# Altium schematic sheet BPF.SchDoc: BPF
size A2 portrait; DocumentNumber: 13; Revision: 2.0; SheetNumber: 13; SheetTotal: 18; DocumentName: Лист 1.SCHDOC
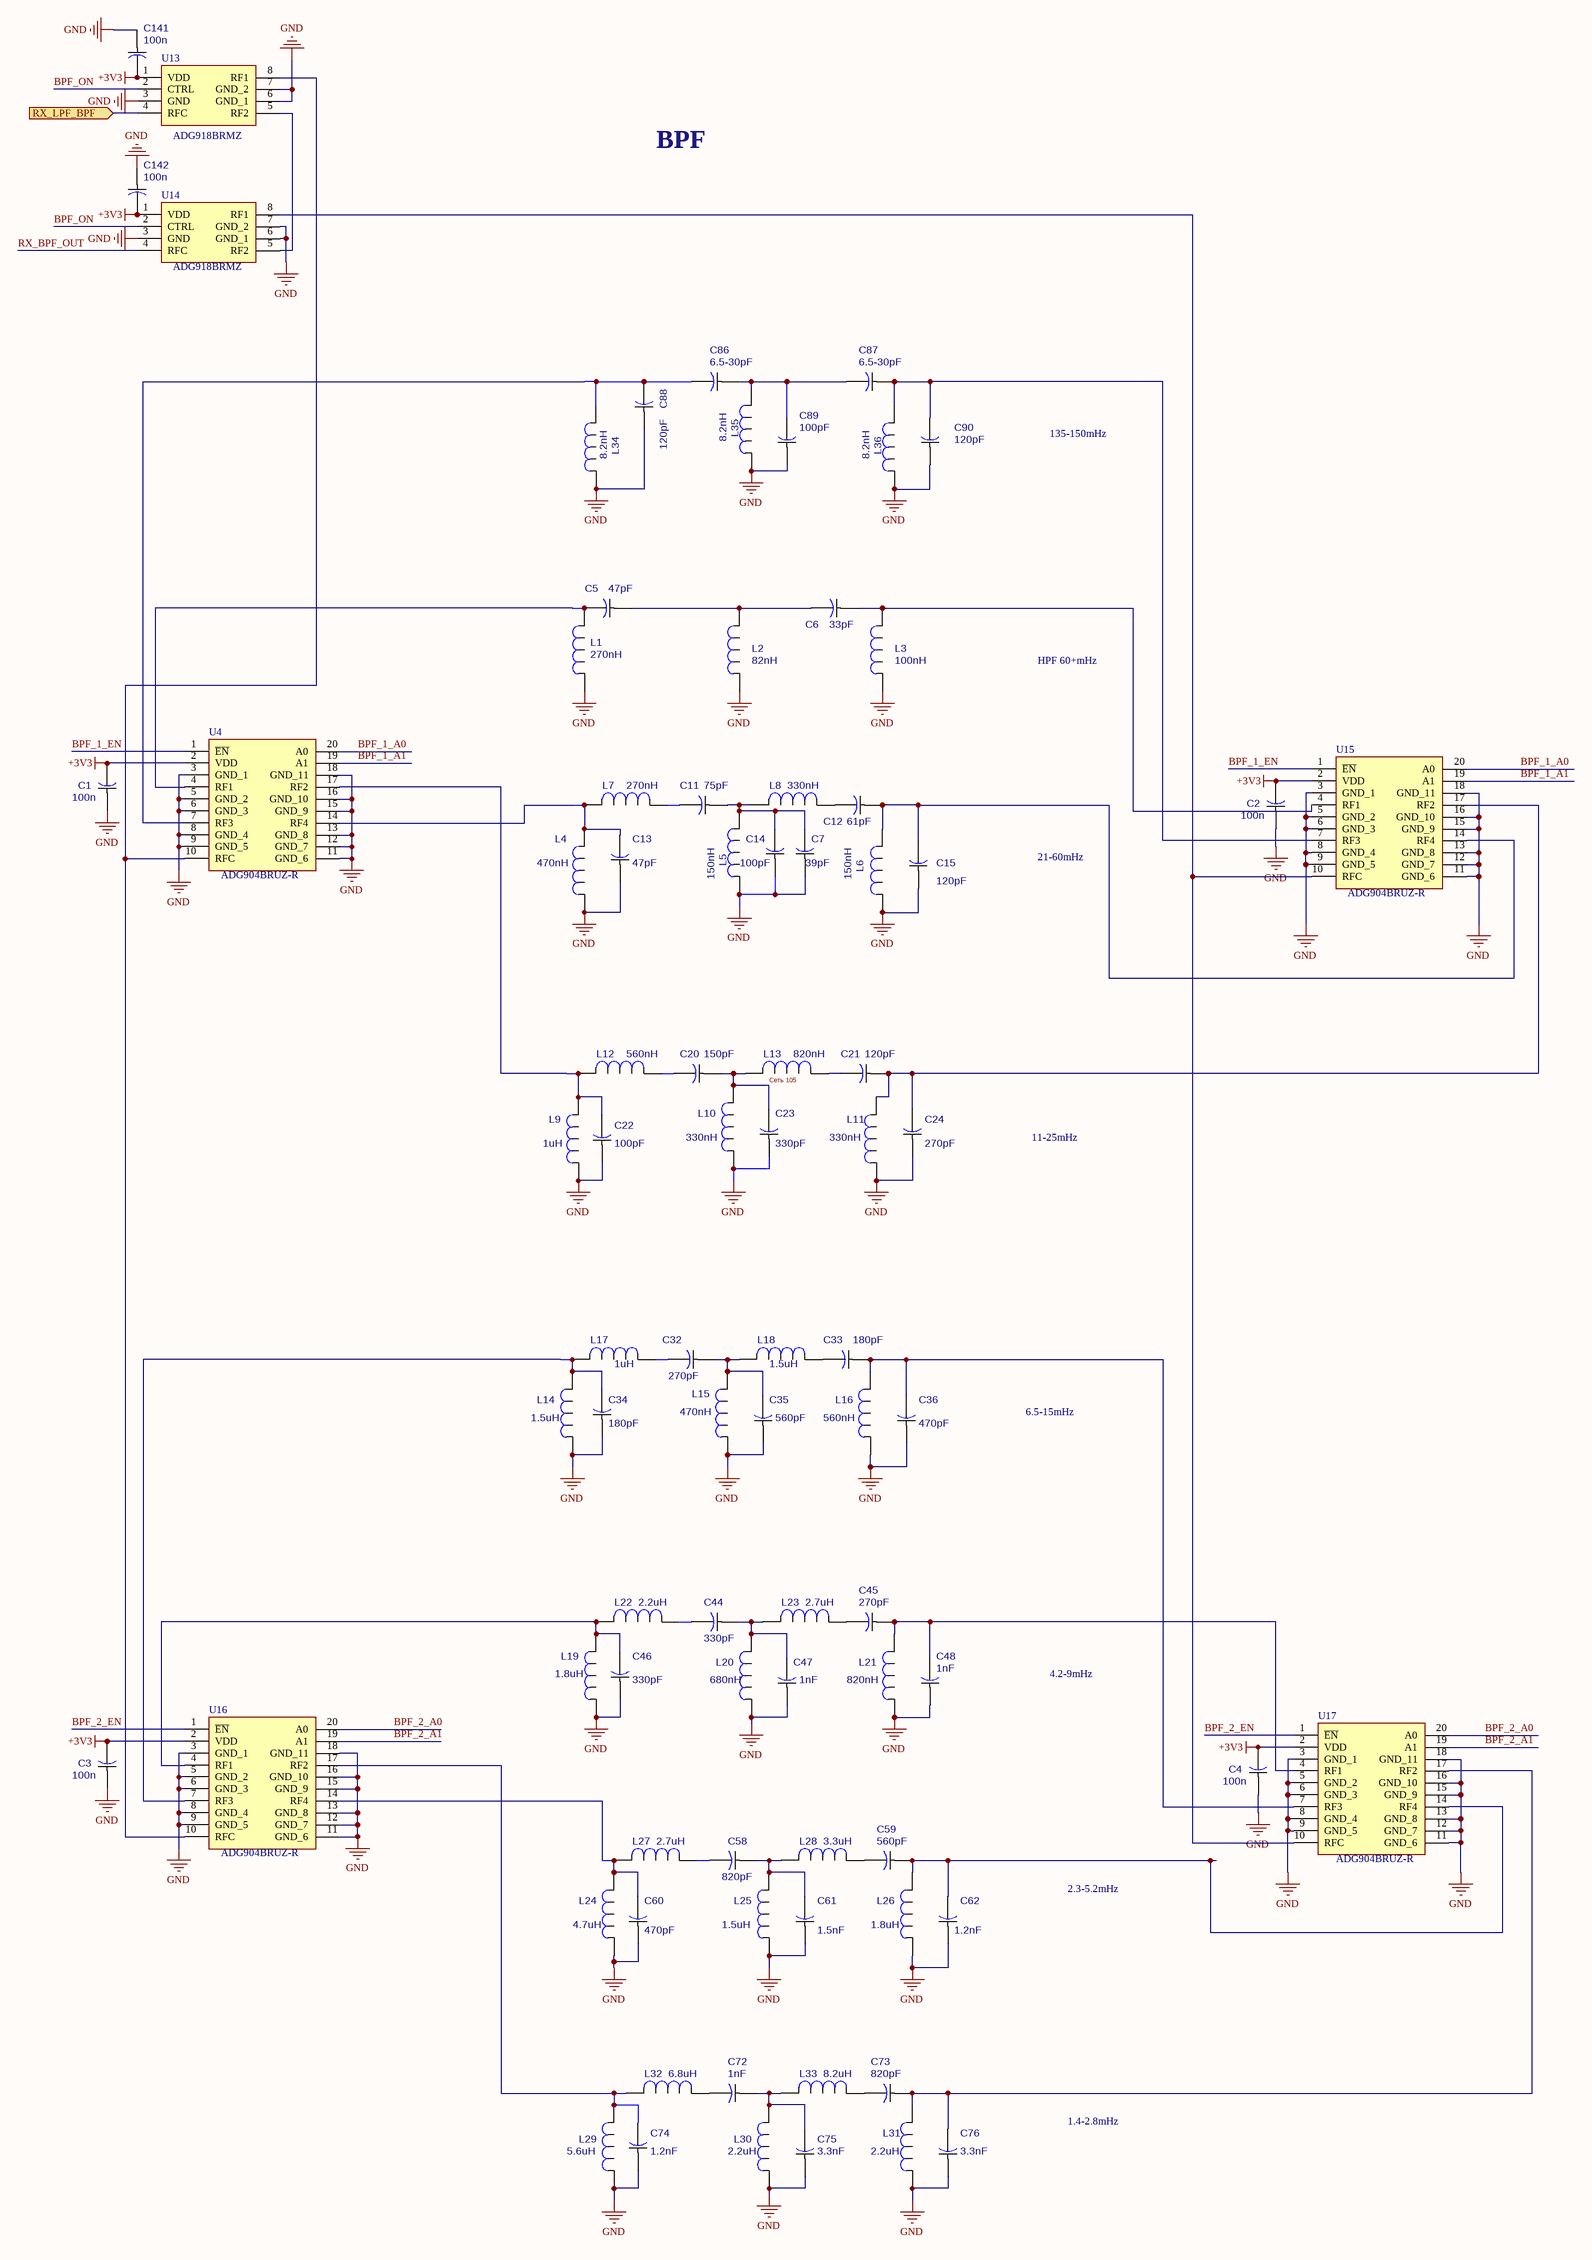
[diagram p0: BPF.SchDoc]

## Parts
C1  100n  [CAP_0805]
C2  100n  [CAP_0805]
C3  100n  [CAP_0805]
C4  100n  [CAP_0805]
C5  47pF  [CAP_0805]
C6  33pF  [CAP_0805]
C7  39pF  [CAP_0805]
C11  75pF  [CAP_0805]
C12  61pF  [CAP_0805]
C13  47pF  [CAP_0805]
C14  100pF  [CAP_0805]
C15  120pF  [CAP_0805]
C20  150pF  [CAP_0805]
C21  120pF  [CAP_0805]
C22  100pF  [CAP_0805]
C23  330pF  [CAP_0805]
C24  270pF  [CAP_0805]
C32  270pF  [CAP_0805]
C33  180pF  [CAP_0805]
C34  180pF  [CAP_0805]
C35  560pF  [CAP_0805]
C36  470pF  [CAP_0805]
C44  330pF  [CAP_0805]
C45  value 270pF  [CAP_0805]  (hidden comment: 51pF)
C46  330pF  [CAP_0805]
C47  1nF  [CAP_0805]
C48  1nF  [CAP_0805]
C58  820pF  [CAP_0805]
C59  value 560pF  [CAP_0805]  (hidden comment: 680pF)
C60  470pF  [CAP_0805]
C61  1.5nF  [CAP_0805]
C62  1.2nF  [CAP_0805]
C72  1nF  [CAP_0805]
C73  820pF  [CAP_0805]
C74  1.2nF  [CAP_0805]
C75  3.3nF  [CAP_0805]
C76  3.3nF  [CAP_0805]
C86  6.5-30pF  [5025[2010]]
C87  6.5-30pF  [5025[2010]]
C88  120pF  [CAP_0805]
C89  100pF  [CAP_0805]
C90  120pF  [CAP_0805]
C141  100n  [CAP_0805]
C142  100n  [CAP_0805]
L1  270nH  [IND_0805]
L2  82nH  [IND_0805]
L3  100nH  [IND_0805]
L4  470nH  [IND_0805]
L5  150nH  [IND_0805]
L6  150nH  [IND_0805]
L7  270nH  [IND_0805]
L8  330nH  [IND_0805]
L9  1uH  [IND_0805]
L10  330nH  [IND_0805]
L11  330nH  [IND_0805]
L12  560nH  [IND_0805]
L13  820nH  [IND_0805]
L14  1.5uH  [IND_0805]
L15  470nH  [IND_0805]
L16  560nH  [IND_0805]
L17  1uH  [IND_0805]
L18  1.5uH  [IND_0805]
L19  1.8uH  [IND_0805]
L20  680nH  [IND_0805]
L21  820nH  [IND_0805]
L22  2.2uH  [IND_0805]
L23  2.7uH  [IND_0805]
L24  4.7uH  [IND_0805]
L25  1.5uH  [IND_0805]
L26  1.8uH  [IND_0805]
L27  2.7uH  [IND_0805]
L28  3.3uH  [IND_0805]
L29  5.6uH  [IND_0805]
L30  2.2uH  [IND_0805]
L31  2.2uH  [IND_0805]
L32  6.8uH  [IND_0805]
L33  8.2uH  [IND_0805]
L34  8.2nH  [IND_0805]
L35  8.2nH  [IND_0805]
L36  8.2nH  [IND_0805]
U4  ADG904BRUZ-R  [SOP65P640X120-20N]
U13  ADG918BRMZ  [SOP65P490X110-8N]
U14  ADG918BRMZ  [SOP65P490X110-8N]
U15  ADG904BRUZ-R  [SOP65P640X120-20N]
U16  ADG904BRUZ-R  [SOP65P640X120-20N]
U17  ADG904BRUZ-R  [SOP65P640X120-20N]

## Ports
RX_LPF_BPF (in)

## Nets
+3V3: C1.2 C2.2 C3.2 C4.2 C141.2 C142.2 U4.2(VDD) U13.1(VDD) U14.1(VDD) U15.2(VDD) U16.2(VDD) U17.2(VDD)
GND: C1.1 C2.1 C3.1 C4.1 C7.1 C13.1 C14.1 C15.1 C22.1 C23.1 C24.1 C34.1 C35.1 C36.1 C46.1 C47.1 C48.1 C60.1 C61.1 C62.1 C74.1 C75.1 C76.1 C88.1 C89.1 C90.1 C141.1 C142.1 L1.1 L2.1 L3.1 L4.1 L5.1 L6.1 L9.1 L10.1 L11.1 L14.1 L15.1 L16.1 L19.1 L20.1 L21.1 L24.1 L25.1 L26.1 L29.1 L30.1 L31.1 L34.1 L35.1 L36.1 U4.3(GND_1) U4.5(GND_2) U4.6(GND_3) U4.8(GND_4) U4.9(GND_5) U4.11(GND_6) U4.12(GND_7) U4.13(GND_8) U4.15(GND_9) U4.16(GND_10) U4.18(GND_11) U13.3(GND) U13.6(GND_1) U13.7(GND_2) U14.3(GND) U14.6(GND_1) U14.7(GND_2) U15.3(GND_1) U15.5(GND_2) U15.6(GND_3) U15.8(GND_4) U15.9(GND_5) U15.11(GND_6) U15.12(GND_7) U15.13(GND_8) U15.15(GND_9) U15.16(GND_10) U15.18(GND_11) U16.3(GND_1) U16.5(GND_2) U16.6(GND_3) U16.8(GND_4) U16.9(GND_5) U16.11(GND_6) U16.12(GND_7) U16.13(GND_8) U16.15(GND_9) U16.16(GND_10) U16.18(GND_11) U17.3(GND_1) U17.5(GND_2) U17.6(GND_3) U17.8(GND_4) U17.9(GND_5) U17.11(GND_6) U17.12(GND_7) U17.13(GND_8) U17.15(GND_9) U17.16(GND_10) U17.18(GND_11)
BPF_1_A0: U4.20(A0) U15.20(A0)
BPF_1_A1: U4.19(A1) U15.19(A1)
BPF_1_EN: U4.1(~{EN}) U15.1(~{EN})
BPF_2_A0: U16.20(A0) U17.20(A0)
BPF_2_A1: U16.19(A1) U17.19(A1)
BPF_2_EN: U16.1(~{EN}) U17.1(~{EN})
BPF_ON: U13.2(CTRL) U14.2(CTRL)
RX_BPF_OUT: U14.4(RFC)
RX_LPF_BPF: U13.4(RFC) ; port RX_LPF_BPF
Сеть 105: C20.1 C23.2 L10.2 L13.1
NetC5_1: C5.1 C6.2 L2.2
NetC5_2: C5.2 L1.2 U4.4(RF1)
NetC6_1: C6.1 L3.2 U15.4(RF1)
NetC7_2: C7.2 C11.1 C14.2 L5.2 L8.1
NetC11_2: C11.2 L7.2
NetC12_1: C12.1 C15.2 L6.2 U15.14(RF4)
NetC12_2: C12.2 L8.2
NetC13_2: C13.2 L4.2 L7.1 U4.14(RF4)
NetC20_2: C20.2 L12.2
NetC21_1: C21.1 C24.2 L11.2 U15.17(RF2)
NetC21_2: C21.2 L13.2
NetC22_2: C22.2 L9.2 L12.1 U4.17(RF2)
NetC32_1: C32.1 C35.2 L15.2 L18.1
NetC32_2: C32.2 L17.2
NetC33_1: C33.1 C36.2 L16.2 U17.7(RF3)
NetC33_2: C33.2 L18.2
NetC34_2: C34.2 L14.2 L17.1 U16.7(RF3)
NetC44_1: C44.1 C47.2 L20.2 L23.1
NetC44_2: C44.2 L22.2
NetC45_1: C45.1 C48.2 L21.2 U17.4(RF1)
NetC45_2: C45.2 L23.2
NetC46_2: C46.2 L19.2 L22.1 U16.4(RF1)
NetC58_1: C58.1 C61.2 L25.2 L28.1
NetC58_2: C58.2 L27.2
NetC59_1: C59.1 C62.2 L26.2 U17.14(RF4)
NetC59_2: C59.2 L28.2
NetC60_2: C60.2 L24.2 L27.1 U16.14(RF4)
NetC72_1: C72.1 C75.2 L30.2 L33.1
NetC72_2: C72.2 L32.2
NetC73_1: C73.1 C76.2 L31.2 U17.17(RF2)
NetC73_2: C73.2 L33.2
NetC74_2: C74.2 L29.2 L32.1 U16.17(RF2)
NetC86_1: C86.1 C87.2 C89.2 L35.2
NetC86_2: C86.2 C88.2 L34.2 U4.7(RF3)
NetC87_1: C87.1 C90.2 L36.2 U15.7(RF3)
NetU4_10: U4.10(RFC) U13.8(RF1) U16.10(RFC)
NetU13_5: U13.5(RF2) U14.5(RF2)
NetU14_8: U14.8(RF1) U15.10(RFC) U17.10(RFC)

## Notes on the sheet
- BPF
- 135-150mHz
- HPF 60+mHz
- 21-60mHz
- 11-25mHz
- 6.5-15mHz
- 4.2-9mHz
- 2.3-5.2mHz
- 1.4-2.8mHz
- Title
- Size:
- Date:
- File:
- A2
- Number:
- Time:
- Revision:
- Sheet
- of

## Library data of the parts
C1-C7 C11-C15 C20-C24 C32-C36 C44-C48 C58-C62 C72-C76 C88-C90 C141 C142 = CAP_0805
  C1-C4 C141 C142: Value: 100n
  C5 C13: Value: 47pF
  C6: Value: 33pF
  C7: Value: 39pF
  C11: Value: 75pF
  C12: Value: 61pF
  C14 C89: Value: 100pF
  C15 C88 C90: Value: 120pF
  C44 C46: Value: 330pF
  C47 C48 C72: Value: 1nF
  C58 C73: Value: 820pF
  C60: Value: 470pF
  C61: Value: 1.5nF
  C62 C74: Value: 1.2nF
  C75 C76: Value: 3.3nF
C86 C87 = CAP_0805: TZC3P300A110; Value: 6.5-30pF
L1-L36 = IND_0805
  L1 L7: Value: 270nH
  L2: Value: 82nH
  L3: Value: 100nH
  L4: Value: 470nH
  L5 L6: Value: 150nH
  L8: Value: 330nH
  L19 L26: Value: 1.8uH
  L20: Value: 680nH
  L21: Value: 820nH
  L22 L30 L31: Value: 2.2uH
  L23 L27: Value: 2.7uH
  L24: Value: 4.7uH
  L25: Value: 1.5uH
  L28: Value: 3.3uH
  L29: Value: 5.6uH
  L32: Value: 6.8uH
  L33: Value: 8.2uH
  L34-L36: Value: 8.2nH
U4 U15-U17 = ADG904BRUZ-R: Integrated Circuit; Manufacturer_Name: Analog Devices; Datasheet Link: http://www.analog.com/static/imported-files/data_sheets/ADG904_904R.pdf; Height: 1.2mm; Manufacturer_Part_Number: ADG904BRUZ-R; Mouser Part Number: 584-ADG904BRUZ-R; Mouser Price/Stock: https://www.mouser.com/Search/Refine.aspx?Keyword=584-ADG904BRUZ-R; RS Part Number: 5385019P; RS Price/Stock: http://uk.rs-online.com/web/p/products/5385019P
U13 U14 = ADG918BRMZ: Integrated Circuit; Manufacturer_Name: Analog Devices; Datasheet Link: http://www.analog.com/static/imported-files/data_sheets/ADG918_919.pdf; Height: 1.1mm; Manufacturer_Part_Number: ADG918BRMZ; Mouser Part Number: 584-ADG918BRMZ; Mouser Price/Stock: https://www.mouser.co.uk/ProductDetail/Analog-Devices/ADG918BRMZ?qs=BpaRKvA4VqHrp1TCwMhfnw%3D%3D; RS Part Number: 4969212P; RS Price/Stock: http://uk.rs-online.com/web/p/products/4969212P
  U14: LCSC Part #: test